# EAGLE design Covox (EAGLE 7.0.0)
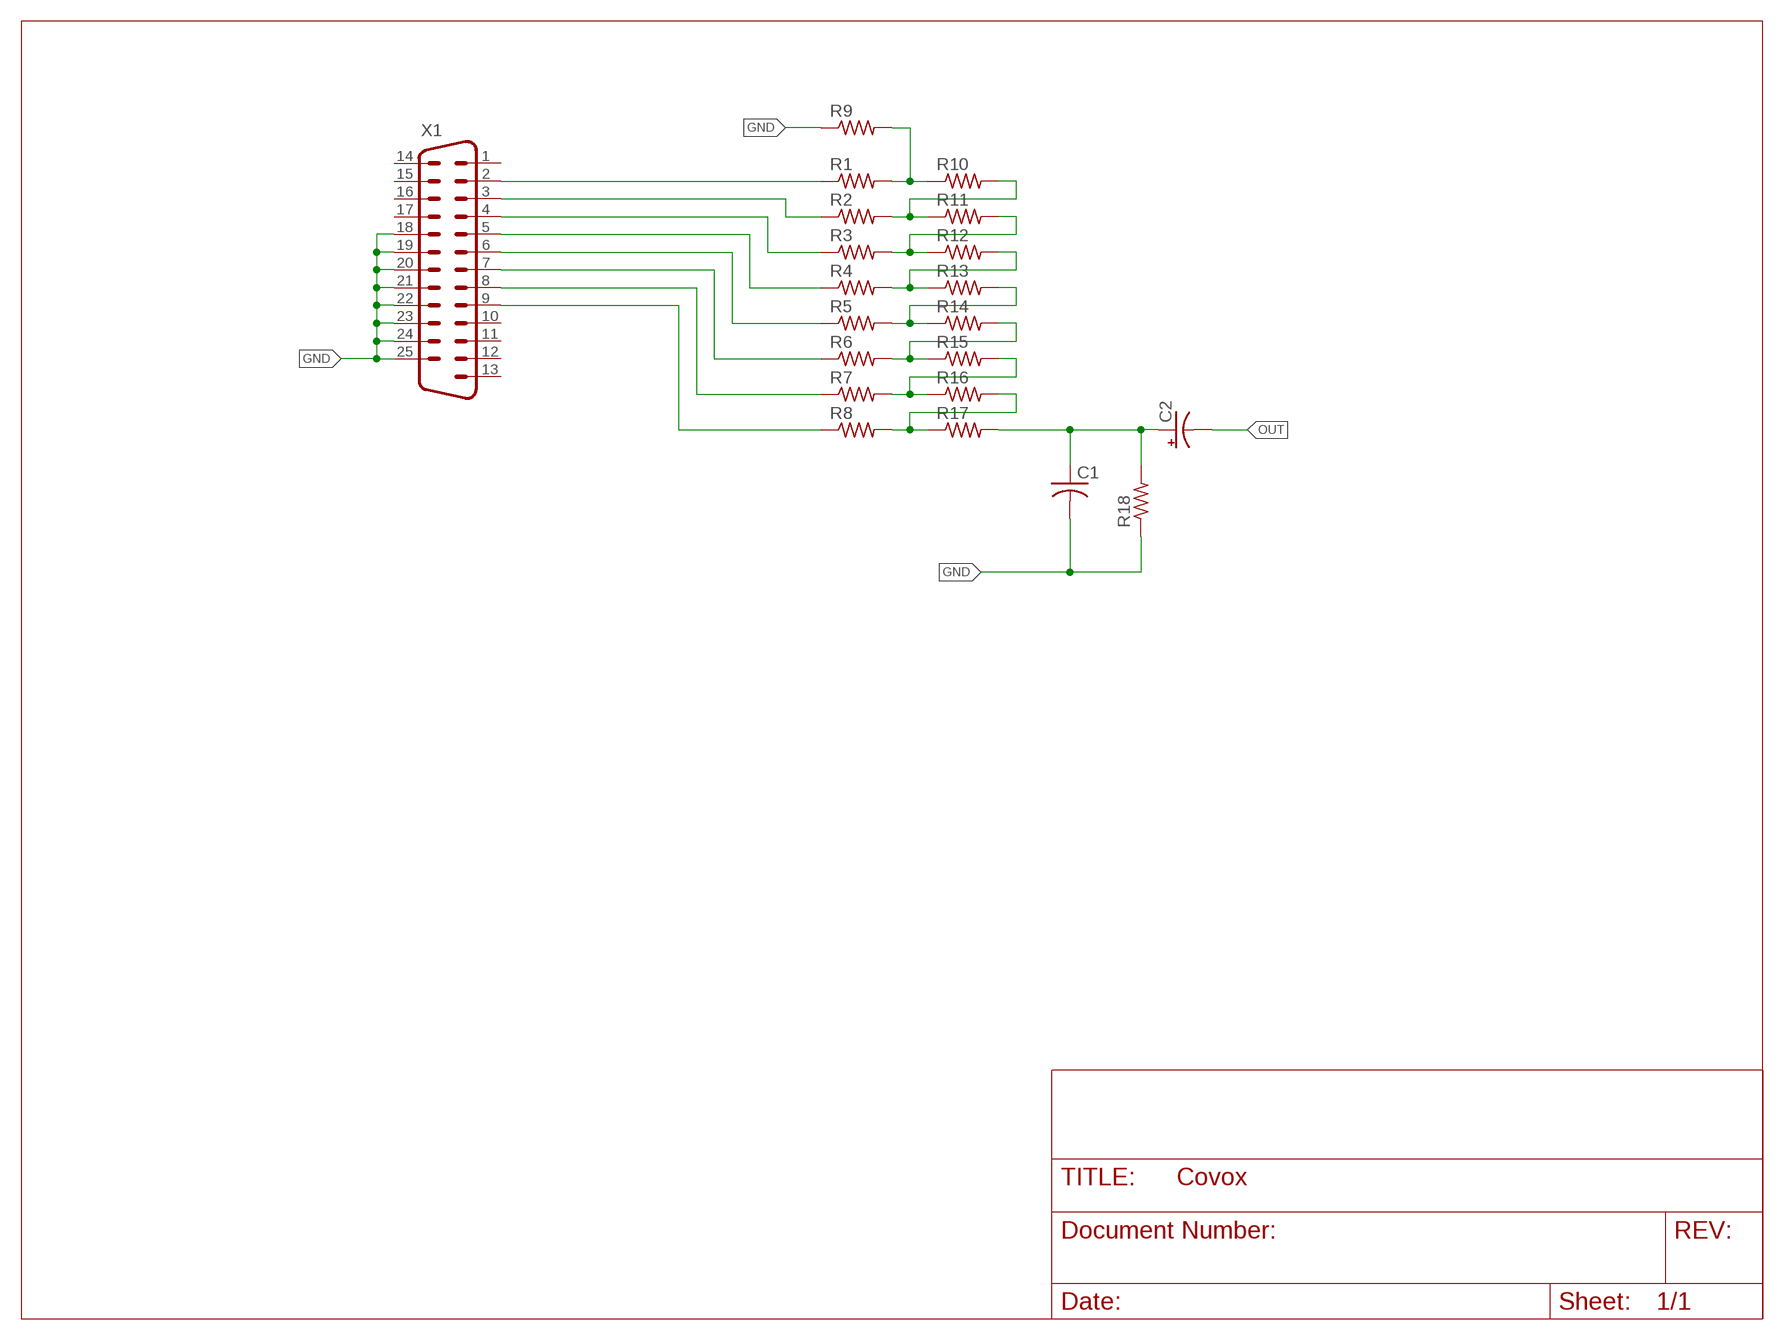
[diagram p0: schematic, sheet 1]

## Parts
C1  C-USC0805K  [C0805K]
C2  CPOL-US153CLV-0405  [153CLV-0405]
R1  R-US_M0805  [M0805]
R2  R-US_M0805  [M0805]
R3  R-US_M0805  [M0805]
R4  R-US_M0805  [M0805]
R5  R-US_M0805  [M0805]
R6  R-US_M0805  [M0805]
R7  R-US_M0805  [M0805]
R8  R-US_M0805  [M0805]
R9  R-US_M0805  [M0805]
R10  R-US_M0805  [M0805]
R11  R-US_M0805  [M0805]
R12  R-US_M0805  [M0805]
R13  R-US_M0805  [M0805]
R14  R-US_M0805  [M0805]
R15  R-US_M0805  [M0805]
R16  R-US_M0805  [M0805]
R17  R-US_M0805  [M0805]
R18  R-US_M0805  [M0805]
X1  DB25D  [M25D]

## Nets
GND: C1.2 R9.1 R18.1 X1.18 X1.19 X1.20 X1.21 X1.22 X1.23 X1.24 X1.25
N$1: R1.1 X1.2
N$2: R2.1 X1.3
N$3: R3.1 X1.4
N$4: R4.1 X1.5
N$5: R5.1 X1.6
N$6: R6.1 X1.7
N$7: R7.1 X1.8
N$8: R8.1 X1.9
N$9: R1.2 R9.2 R10.1
N$10: R2.2 R10.2 R11.1
N$11: R3.2 R11.2 R12.1
N$12: R4.2 R12.2 R13.1
N$13: R5.2 R13.2 R14.1
N$14: R6.2 R14.2 R15.1
N$15: R7.2 R15.2 R16.1
N$16: R8.2 R16.2 R17.1
N$17: C1.1 C2.+ R17.2 R18.2
OUT: C2.-
Unconnected: X1.1 X1.10 X1.11 X1.12 X1.13 X1.14 X1.15 X1.16 X1.17

## Library data of the parts
C1 = rcl:C-US: CAPACITOR, American symbol
C2 = rcl:CPOL-US: POLARIZED CAPACITOR, American symbol
R1-R18 = rcl:R-US_: RESISTOR, American symbol
X1 = SparkFun-Connectors:DB25: Various DB25 connectors

## Board
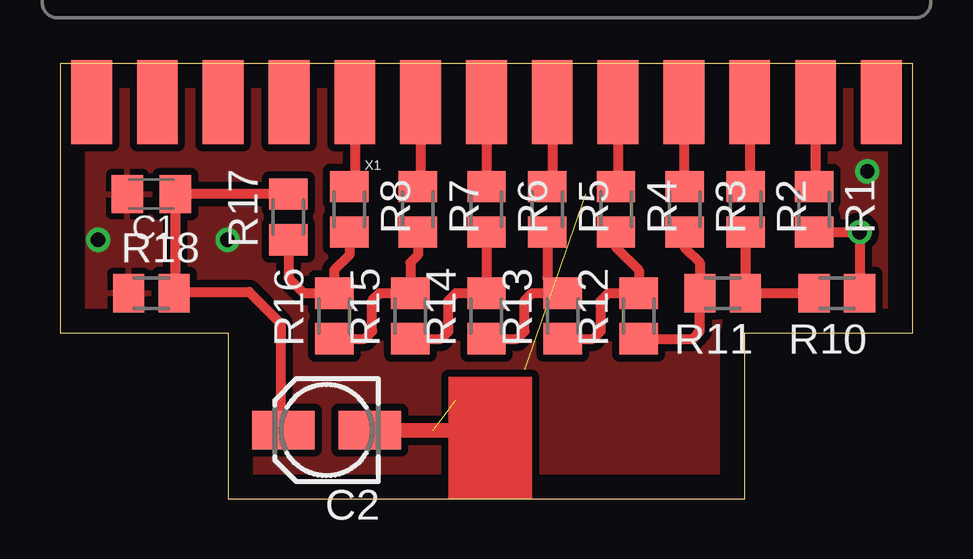
[diagram p1: board, top side]
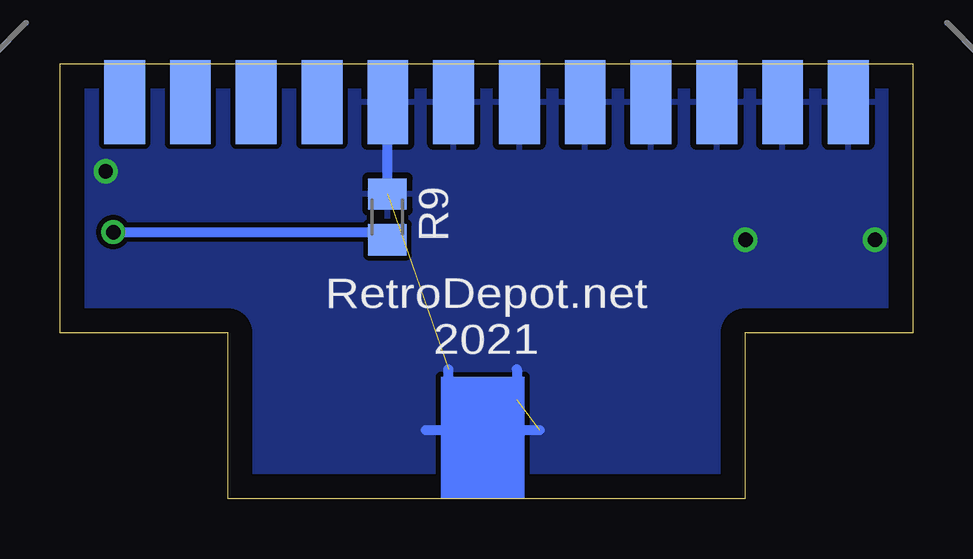
[diagram p2: board, bottom side, seen from below]

Size 35.56 x 18.14 mm. Coordinates in mm from the lower left corner, seen from the top.
Outline: 0,6.91 7,6.91 7,0 28.56,0 28.56,6.91 35.56,6.91 35.56,18.14 0,18.14 0,6.91
Copper layers (1*16): Top 0.035mm / dielectric 1.5mm / Bottom 0.035mm
Design rules "default": minimum track width 10mil, minimum drill 24mil, track to track 8mil, track to pad 8mil, pad to pad 8mil, via to via 8mil, smd to smd 8mil, copper to edge 40mil, drill to drill 8mil, minimum pad ring 10mil, minimum via ring 8mil, stop-mask expansion 4mil, vias tented up to drill 0mil, thermal gap 10mil

### Footprints (pad centres in the part's own frame; a part is rotated, then mirrored left to right if it is on the bottom)
C0805K = smd 1.3 x 1.6: 1 -1,0; 2 1,0
153CLV-0405 = smd 2.6 x 1.6: + 1.8,0; - -1.8,0
M0805 = smd 1.3 x 1.6: 1 -0.95,0; 2 0.95,0
M25D = smd 1.7 x 3.5: 1 16.459,-6.045; 2 13.716,-6.045; 3 10.973,-6.045; 4 8.23,-6.045; 5 5.486,-6.045; 6 2.743,-6.045; 7 0,-6.045; 8 -2.743,-6.045; 9 -5.486,-6.045; 10 -8.23,-6.045; 11 -10.973,-6.045; 12 -13.716,-6.045; 13 -16.459,-6.045 | smd 1.7 x 3.5 bottom: 14 15.088,-6.045; 15 12.344,-6.045; 16 9.601,-6.045; 17 6.858,-6.045; 18 4.115,-6.045; 19 1.372,-6.045; 20 -1.372,-6.045; 21 -4.115,-6.045; 22 -6.858,-6.045; 23 -9.601,-6.045; 24 -12.344,-6.045; 25 -15.088,-6.045

### Placement (x,y rotation side)
C1  3.81,12.7 180 top
C2  11.11,2.86 180 top
R1  31.43,12.06 270 top
R2  28.57,12.06 270 top
R3  26.04,12.06 270 top
R4  23.18,12.06 270 top
R5  20.32,12.06 270 top
R6  17.78,12.06 270 top
R7  14.92,12.06 270 top
R8  12.06,12.06 270 top
R9  21.91,11.75 270 bottom
R10  32.38,8.57 180 top
R11  27.62,8.57 180 top
R12  24.13,7.62 90 top
R13  20.95,7.62 90 top
R14  17.78,7.62 90 top
R15  14.61,7.62 90 top
R16  11.43,7.62 90 top
R17  9.53,11.75 90 top
R18  3.81,8.57 0 top
X1  17.78,22.59 0 top

### Tracks (layer width: path | path; a pad name or v marks a point on that pad's centre or on a via)
GND  (via drill 0.6)  (2 unrouted)
  Bottom 0.406: R9.1 21.91,16.53 X1.18 | 16.51,5.4 16.51,4.13 19.05,4.13 arc90 19.37,4.45 19.37,5.4 | 15.56,2.86 20.32,2.86
  other vias: 1.59,10.79 6.99,10.79 33.66,13.65
  pour Bottom: -0.32,18.41 35.88,18.41 35.88,6.67 28.89,6.67 28.89,-0.32 6.67,-0.32 6.67,6.67 -0.32,6.67
  pour Top (isolate 0.305): -0.32,18.41 35.88,18.41 35.88,6.67 28.89,6.67 28.89,-0.32 6.67,-0.32 6.67,0 6.67,6.67 -0.32,6.67
N$1
  Top 0.406: X1.2 31.5,13.08 R1.1
N$2
  Top 0.406: X1.3 28.75,13.19 R2.1
N$3
  Top 0.406: X1.4 26.01,13.04 R3.1
N$4
  Top 0.406: X1.5 23.27,13.1 R4.1
N$5
  Top 0.406: X1.6 20.52,13.22 R5.1
N$6
  Top 0.406: X1.7 R6.1
N$7
  Top 0.406: X1.8 15.04,13.13 R7.1
N$8
  Top 0.406: X1.9 12.29,13.24 R8.1
N$9  (via drill 0.6)
  Top 0.406: 33.34,8.26 R10.1 v33.34,11.11 v33.34,11.12 R1.2
  Bottom 0.406: v33.34,11.11 22.22,11.11 R9.2
N$10
  Top 0.406: R2.2 R11.1 R10.2
N$11
  Top 0.406: R3.2 26.04,10.48 26.67,9.84 R11.2 26.67,6.99 26.36,6.67 R12.1
N$12
  Top 0.406: R13.1 22.23,6.67 22.54,6.99 22.54,8.26 22.86,8.57 R12.2 24.13,9.53 23.18,10.48 R4.2
N$13
  Top 0.406: R14.1 19.05,6.67 19.37,6.99 19.37,8.26 19.68,8.57 R13.2 20.32,9.21 R5.2
N$14
  Top 0.406: R15.1 15.88,6.67 16.19,6.99 16.19,8.26 16.51,8.57 R14.2 R6.2
N$15
  Top 0.406: R16.1 12.7,6.67 13.02,6.99 13.02,8.26 13.34,8.57 R15.2 14.61,9.84 14.92,10.16 R7.2
N$16
  Top 0.406: R8.2 12.06,10.16 11.43,9.53 R16.2 10.16,8.57 9.53,9.21 R17.1
N$17
  Top 0.406: R17.2 C1.1 4.81,8.62 | 4.81,8.62 R18.2 | 4.81,8.62 7.89,8.62 9.21,7.3 9.21,2.96 C2.+
N$20
  Top 0.61: 13.34,2.86 16.83,2.86
(copper drawn outside any net)
  shapes: Bottom area x1, Top area x1

### Text on the board
bPlace: RetroDepot.net / 2021